# Altium project DB10005_DieBieMS.PrjPcb (part 2 of 2)

## Sheet DB10005_USBSerial.SchDoc: USB Serial interface
size A4; SheetNumber: 7; SheetTotal: 7
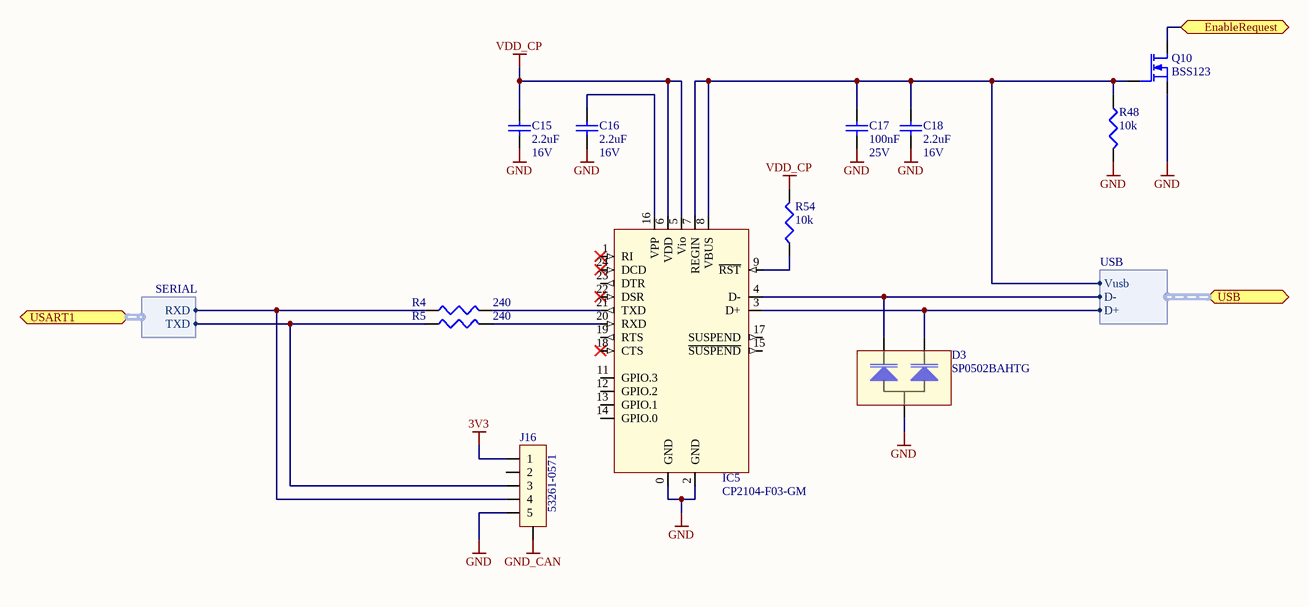
[diagram p7: DB10005_USBSerial.SchDoc]

### Parts
C15  2.2uF  Voltage Rating: 16V  [C0603]
C16  2.2uF  Voltage Rating: 16V  [C0603]
C17  100nF  Voltage Rating: 25V  [C0402]
C18  2.2uF  Voltage Rating: 16V  [C0603]
D3  SP0502BAHTG  [SOT23]
IC5  CP2104-F03-GM  [QFN24]
J16  53261-0571  [53261-0571]
Q10  BSS123  [SOT-23]
R4  240  [0402]
R5  240  [0402]
R48  10k  [0402]
R54  10k  [0402]

### Ports
EnableRequest, USART1 (harness SERIAL), USB (harness USB)

### Harnesses
USB: Vusb, D+, D-
SERIAL: RXD, TXD

### Nets
3V3: J16.1
GND: C15.1 C16.1 C17.1 C18.1 D3.A IC5.0(GND) IC5.2(GND) J16.5 Q10.S R48.1
GND_CAN: J16.0(SHLD)
VDD_CP: C15.2 IC5.5(Vio) IC5.6(VDD) R54.2
USB_RX: J16.4 R4.1 ; port USART1.RXD
USB_TX: J16.3 R5.1 ; port USART1.TXD
NetC16_2: C16.2 IC5.16(VPP)
NetC17_2: C17.2 C18.2 IC5.7(REGIN) IC5.8(VBUS) Q10.G R48.2 ; port USB.Vusb
NetD3_K1: D3.K1 IC5.4(D-) ; port USB.D-
NetD3_K2: D3.K2 IC5.3(D+) ; port USB.D+
NetD6_4: Q10.D ; port EnableRequest
NetIC5_9: IC5.9(~{RST}) R54.1
NetIC5_20: IC5.20(RXD) R5.2
NetIC5_21: IC5.21(TXD) R4.2

Not connected (* = marked no-connect by the designer): IC5 1(RI)* 11(GPIO.3) 12(GPIO.2) 13(GPIO.1) 14(GPIO.0) 15(~{SUSPEND}) 17(SUSPEND) 18(CTS)* 19(RTS) 22(DSR)* 23(DTR) 24(DCD)*; J16 2

### Notes on the sheet
- Title
- Size:
- Date:
- A4
- Number:
- Time:
- Revision:
- Sheet
- of
- File:

### Library data of the parts
C15 C16 C18 = 2.2uF/0603/CER/16V: Capacitor, 2.2uF, 16V, X5R; Capacitance Tolerance: +/- 10%; Capacitor Case Style: 0603; Brand Number: GRM188R61C225KE15D; Brand: MURATA; Dielectric Characteristic: X5R; Capacitance: 2.2uF; Temperature Range: -55°C to 85°C; Price: 0,077; Order Code Supplier: 1735526; Supplier: Farnell
C17 = 100nF/0402/CER/25V: Capacitor, 100nF, 25V, X7R; Capacitance Tolerance: 10nF; Capacitor Case Style: 0402; Brand Number: GRM155R71E104KE14D; Brand: MULTICOMP; Dielectric Characteristic: X7R; Capacitance: 100nF; Temperature Range: -55 to +125 C; Price: 0,0225; Order Code Supplier: 2456106; Supplier: Farnell
D3 = SP0502BAHTG: Diode TVS Dual, Vrwm: 5.5V Vc: 8V; Brand: LITTLEFUSE; Case Style: SOT-23; Brand Number: SP0502BAHTG; Clamping Voltage: 8V; Order Code Supplier: 1827631; Price: 0,80; Supplier: Farnell; Temperature Range: -40°C to +125°C; Vrwm: 5.5V
IC5 = CP2104-F03-GM: USB to UART converter; Case Style: QFN24; Price: 1,65; Order Code Supplier: 757-4983; Brand Number: CP2104-F03-GM; Supplier: RS-Components
J16 = 53261-0571: PicoBlade 53261 Series, 5Pin, Right Angle; Brand: MOLEX; Pitch: 1.25mm; Brand Number: 53261-0571; Case Style: 53261-0571; Order Code Supplier: 1125360; Price: 1,20; Supplier: Farnell
Q10 = BSS123: Mosfet, N-channel, Vds:100V, Id:0.15A, Vgs-th:2.8V, Rds-on:3.5ohm; Brand: NXP; Drain Current: 0.15A; Drain Source Voltage: 100V; Gate Source Voltage: 20V; On Resistance: 3.5ohm; Threshold Voltage: 2.8V; Brand Number: BSS123; Case Style: SOT-23; Order Code Supplier: 1510764; Price: 0,082; Supplier: Farnell; Temperature Range: -55°C to +150°C; Transistor Polarity: N-channel
R4 R5 = 240/0402/0063W/50V: Resistor, 240, 0.1%, 0.0625W, 50V, 100PPM, 0402; Brand: VISHAY DRALORIC; Brand Number: CRCW0402240RFKED; Power Rating: 0.063W; Case Style: 0402; Order Code Supplier: 2121522; Price: 0,0006; Resistance: 240; Supplier: Farnell; Temperature Coefficient: ± 100PPM; Temperature Range: -55°C to +125°C; Voltage Rating: 50V
R48 R54 = 10k/0402/0063W/50V: Resistor, 10k, 0.1%, 0.0625W, 50V, 100PPM, 0402; Brand: VISHAY DRALORIC; Brand Number: CRCW040210K0FKED; Power Rating: 0.063W; Case Style: 0402; Order Code Supplier: 2121730; Price: 0,0005; Resistance: 10k; Supplier: Farnell; Temperature Coefficient: ± 100PPM; Temperature Range: -55°C to +125°C; Voltage Rating: 50V

## Sheet DB10005_Wireless.SchDoc
size A4
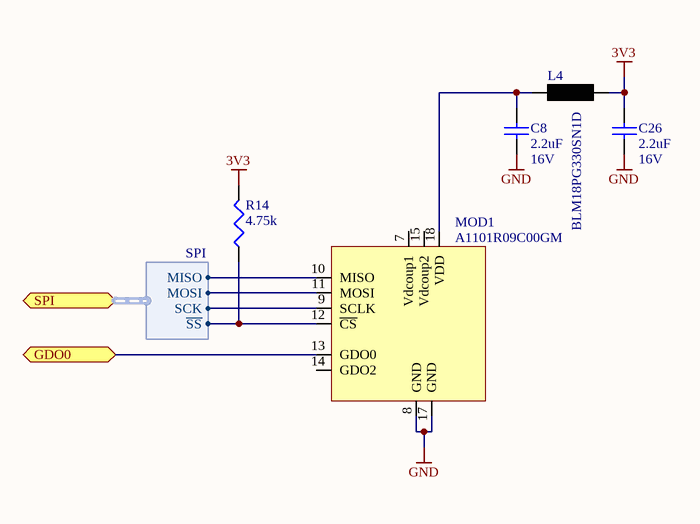
[diagram p8: DB10005_Wireless.SchDoc]

### Parts
C8  2.2uF  Voltage Rating: 16V  [C0603]
C26  2.2uF  Voltage Rating: 16V  [C0603]
L4  BLM18PG330SN1D  [L0603]
MOD1  A1101R09C00GM  [AxxLR09_Short]
R14  4.75k  [0402]

### Ports
GDO0, SPI (harness SPI)

### Harnesses
SPI: ~{SS}, SCK, MISO, MOSI

### Nets
3V3: C26.2 L4.2 R14.2
GND: C8.1 C26.1 MOD1.8(GND) MOD1.17(GND)
MISO: MOD1.10(MISO) ; port SPI.MISO
MOSI: MOD1.11(MOSI) ; port SPI.MOSI
SCK: MOD1.9(SCLK) ; port SPI.SCK
SPI_WT_SS: MOD1.12(~{CS}) R14.1 ; port SPI.~{SS}
Wireless_GDO0: MOD1.13(GDO0) ; port GDO0
NetC8_2: C8.2 L4.1 MOD1.18(VDD)

Not connected (* = marked no-connect by the designer): MOD1 7(Vdcoup1) 14(GDO2) 15(Vdcoup2)

### Library data of the parts
C8 C26 = 2.2uF/0603/CER/16V: as C15 on sheet DB10005_USBSerial; Dielectric Characteristic: X5R; Capacitance: 2.2uF; Temperature Range: -55°C to 85°C; Price: 0,077; Order Code Supplier: 1735526; Supplier: Farnell
L4 = BLM18PG330SN1D: Ferrite Bead, Impedance:33ohm, DC Resistance Max:0.025ohm, DC Current Rating:3A; Brand: MURATA; Case Style: 0603; Brand Number: BLM18PG330SN1D; Price: 0,048; Supplier: Farnell; Order Code Supplier: 1515742
MOD1 = A1101R09C00GM: SubRF tranceiver module; Brand: Anaren; Order Code Supplier: 2096118; Brand Number: A1101R09C00GM; Supplier: Farnell; Price: 12,47
R14 = 4.75k/0402/0063W/50V: Resistor, 4.75k, 0.1%, 0.0625W, 50V, 100PPM, 0402; Brand: VISHAY DRALORIC; Brand Number: CRCW04024K75FKED; Power Rating: 0.063W; Case Style: 0402; Order Code Supplier: 2121689; Price: 0,0006; Resistance: 4.75k; Supplier: Farnell; Temperature Coefficient: ± 100PPM; Temperature Range: -55°C to +125°C; Voltage Rating: 50V

## Sheet DB10005_Software.SchDoc
size A3 portrait
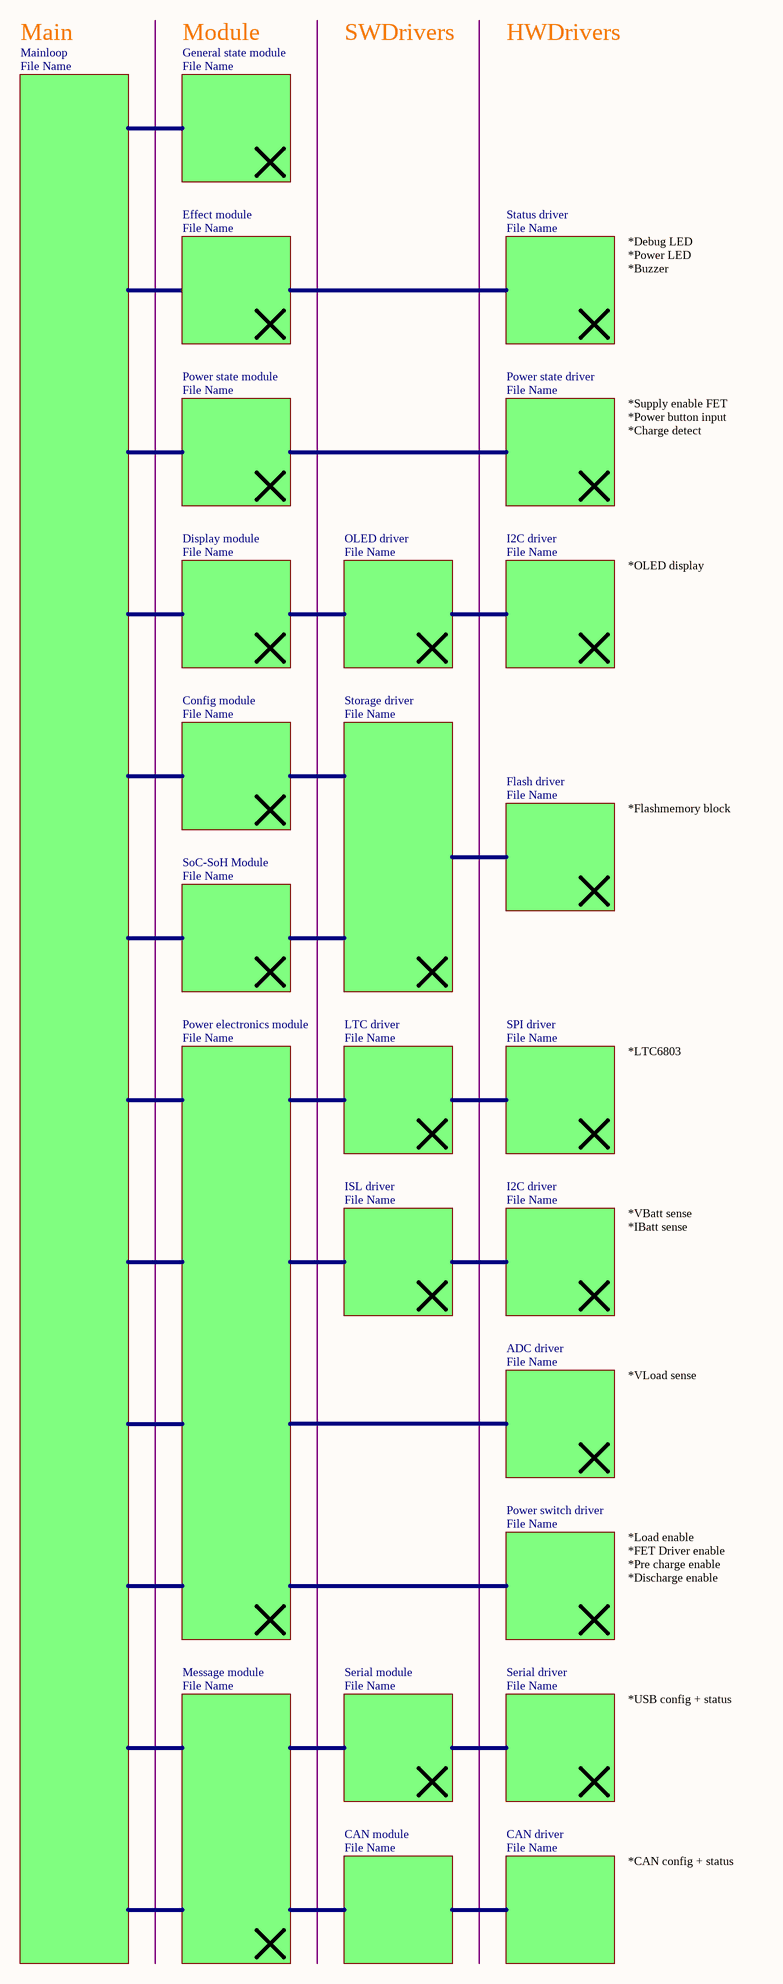
[diagram p9: DB10005_Software.SchDoc]

### Sub-sheets
ADC driver = File Name (file not in this document): no entries
CAN driver = File Name (file not in this document): no entries
CAN module = File Name (file not in this document): no entries
Config module = File Name (file not in this document): no entries
Display module = File Name (file not in this document): no entries
Effect module = File Name (file not in this document): no entries
Flash driver = File Name (file not in this document): no entries
General state module = File Name (file not in this document): no entries
I2C driver = File Name (file not in this document): no entries
I2C driver = File Name (file not in this document): no entries
ISL driver = File Name (file not in this document): no entries
LTC driver = File Name (file not in this document): no entries
Mainloop = File Name (file not in this document): no entries
Message module = File Name (file not in this document): no entries
OLED driver = File Name (file not in this document): no entries
Power electronics module = File Name (file not in this document): no entries
Power state driver = File Name (file not in this document): no entries
Power state module = File Name (file not in this document): no entries
Power switch driver = File Name (file not in this document): no entries
Serial driver = File Name (file not in this document): no entries
Serial module = File Name (file not in this document): no entries
SoC-SoH Module = File Name (file not in this document): no entries
SPI driver = File Name (file not in this document): no entries
Status driver = File Name (file not in this document): no entries
Storage driver = File Name (file not in this document): no entries

### Notes on the sheet
- Main
- Module
- SWDrivers
- HWDrivers
- *Debug LED
- *Power LED
- *Buzzer
- *Supply enable FET
- *Power button input
- *Charge detect
- *OLED display
- *Flashmemory block
- *LTC6803
- *VBatt sense
- *IBatt sense
- *VLoad sense
- *FET Driver enable
- *Pre charge enable
- *Load enable
- *Discharge enable
- *USB config + status
- *CAN config + status
- Title
- Size:
- Date:
- A3
- Number:
- Time:
- Revision:
- Sheet
- of
- File:

## Nets that join several sheets
3V3: DB10005_TopLevel (8 pins), DB10005_Controller (12 pins), DB10005_PowerSwitch (5 pins), DB10005_PowerManagement (C36.2 D15.1 D16.1 R41.1), DB10005_CAN (C11.2 C12.2 IC4.1), DB10005_USBSerial (J16.1), DB10005_Wireless (C26.2 L4.2 R14.2)
5V_CAN: DB10005_TopLevel (J6.2 J9.2 TP2.1), DB10005_CAN (C13.2 C14.2 IC4.8)
GND: DB10005_TopLevel (17 pins), DB10005_BatteryStackMonitor (17 pins), Battery stack monitor/CELL1 (C25_CELL1.1), Battery stack monitor/CELL2 (C25_CELL2.1), Battery stack monitor/CELL3 (C25_CELL3.1), Battery stack monitor/CELL4 (C25_CELL4.1), Battery stack monitor/CELL5 (C25_CELL5.1), Battery stack monitor/CELL6 (C25_CELL6.1), Battery stack monitor/CELL7 (C25_CELL7.1), Battery stack monitor/CELL8 (C25_CELL8.1), Battery stack monitor/CELL9 (C25_CELL9.1), Battery stack monitor/CELL10 (C25_CELL10.1), Battery stack monitor/CELL11 (C25_CELL11.1), Battery stack monitor/CELL12 (C25_CELL12.1), DB10005_Controller (19 pins), DB10005_PowerSwitch (22 pins), DB10005_PowerManagement (16 pins), DB10005_CAN (6 pins), DB10005_USBSerial (10 pins), DB10005_Wireless (C8.1 C26.1 MOD1.8 MOD1.17)
GND_CAN: DB10005_TopLevel (5 pins), DB10005_CAN (7 pins), DB10005_USBSerial (J16.0)
BATT+: DB10005_TopLevel (J2.1), DB10005_PowerSwitch (5 pins)
Buzzer: DB10005_TopLevel (Q11.G R72.1), DB10005_Controller (IC1.38)
C1: DB10005_BatteryStackMonitor (U1.24), Battery stack monitor/CELL1 (C25_CELL1.2 D23_CELL1.2 R36_CELL1.2), Battery stack monitor/CELL2 (D23_CELL2.1)
C2: DB10005_BatteryStackMonitor (U1.22), Battery stack monitor/CELL2 (C25_CELL2.2 D23_CELL2.2 R36_CELL2.2), Battery stack monitor/CELL3 (D23_CELL3.1)
C3: DB10005_BatteryStackMonitor (U1.20), Battery stack monitor/CELL3 (C25_CELL3.2 D23_CELL3.2 R36_CELL3.2), Battery stack monitor/CELL4 (D23_CELL4.1)
C4: DB10005_BatteryStackMonitor (U1.18), Battery stack monitor/CELL4 (C25_CELL4.2 D23_CELL4.2 R36_CELL4.2), Battery stack monitor/CELL5 (D23_CELL5.1)
C5: DB10005_BatteryStackMonitor (U1.16), Battery stack monitor/CELL5 (C25_CELL5.2 D23_CELL5.2 R36_CELL5.2), Battery stack monitor/CELL6 (D23_CELL6.1)
C6: DB10005_BatteryStackMonitor (U1.14), Battery stack monitor/CELL6 (C25_CELL6.2 D23_CELL6.2 R36_CELL6.2), Battery stack monitor/CELL7 (D23_CELL7.1)
C7: DB10005_BatteryStackMonitor (U1.12), Battery stack monitor/CELL7 (C25_CELL7.2 D23_CELL7.2 R36_CELL7.2), Battery stack monitor/CELL8 (D23_CELL8.1)
C8: DB10005_BatteryStackMonitor (U1.10), Battery stack monitor/CELL8 (C25_CELL8.2 D23_CELL8.2 R36_CELL8.2), Battery stack monitor/CELL9 (D23_CELL9.1)
C9: DB10005_BatteryStackMonitor (U1.8), Battery stack monitor/CELL9 (C25_CELL9.2 D23_CELL9.2 R36_CELL9.2), Battery stack monitor/CELL10 (D23_CELL10.1)
C10: DB10005_BatteryStackMonitor (U1.6), Battery stack monitor/CELL10 (C25_CELL10.2 D23_CELL10.2 R36_CELL10.2), Battery stack monitor/CELL11 (D23_CELL11.1)
C11: DB10005_BatteryStackMonitor (U1.4), Battery stack monitor/CELL11 (C25_CELL11.2 D23_CELL11.2 R36_CELL11.2), Battery stack monitor/CELL12 (D23_CELL12.1)
C12: DB10005_BatteryStackMonitor (U1.2), Battery stack monitor/CELL12 (C25_CELL12.2 D23_CELL12.2 R36_CELL12.2)
CAN_RX: DB10005_Controller (IC1.32), DB10005_CAN (IC4.2)
CAN_TX: DB10005_Controller (IC1.33), DB10005_CAN (IC4.3)
CANH: DB10005_TopLevel (J6.4 J9.4 R69.2 TP4.1), DB10005_CAN (D1.K1 IC4.7)
CANL: DB10005_TopLevel (J6.3 J9.3 R69.1 TP5.1), DB10005_CAN (D1.K2 IC4.6)
ChargeEnable: DB10005_Controller (IC1.18), DB10005_PowerSwitch (Q12.D R22.1)
ChargeIn: DB10005_TopLevel (J1.1), DB10005_PowerSwitch (D7.A1 D7.A2 D8.2)
CM1: DB10005_BatteryStackMonitor (R56.2), Battery stack monitor/CELL1 (D23_CELL1.1)
CN1: DB10005_TopLevel (J12.1), DB10005_BatteryStackMonitor (R52.2), Battery stack monitor/CELL1 (R38_CELL1.1 R39_CELL1.1)
CN2: DB10005_TopLevel (J12.2), Battery stack monitor/CELL1 (F2_CELL1.1 Q5_CELL1.S R36_CELL1.1 R39_CELL1.2), Battery stack monitor/CELL2 (R38_CELL2.1 R39_CELL2.1)
CN3: DB10005_TopLevel (J12.3), Battery stack monitor/CELL2 (F2_CELL2.1 Q5_CELL2.S R36_CELL2.1 R39_CELL2.2), Battery stack monitor/CELL3 (R38_CELL3.1 R39_CELL3.1)
CN4: DB10005_TopLevel (J12.4), Battery stack monitor/CELL3 (F2_CELL3.1 Q5_CELL3.S R36_CELL3.1 R39_CELL3.2), Battery stack monitor/CELL4 (R38_CELL4.1 R39_CELL4.1)
CN5: DB10005_TopLevel (J12.5), Battery stack monitor/CELL4 (F2_CELL4.1 Q5_CELL4.S R36_CELL4.1 R39_CELL4.2), Battery stack monitor/CELL5 (R38_CELL5.1 R39_CELL5.1)
CN6: DB10005_TopLevel (J12.6), Battery stack monitor/CELL5 (F2_CELL5.1 Q5_CELL5.S R36_CELL5.1 R39_CELL5.2), Battery stack monitor/CELL6 (R38_CELL6.1 R39_CELL6.1)
CN7: DB10005_TopLevel (J12.7), Battery stack monitor/CELL6 (F2_CELL6.1 Q5_CELL6.S R36_CELL6.1 R39_CELL6.2), Battery stack monitor/CELL7 (R38_CELL7.1 R39_CELL7.1)
CN8: DB10005_TopLevel (J12.8), Battery stack monitor/CELL7 (F2_CELL7.1 Q5_CELL7.S R36_CELL7.1 R39_CELL7.2), Battery stack monitor/CELL8 (R38_CELL8.1 R39_CELL8.1)
CN9: DB10005_TopLevel (J12.9), Battery stack monitor/CELL8 (F2_CELL8.1 Q5_CELL8.S R36_CELL8.1 R39_CELL8.2), Battery stack monitor/CELL9 (R38_CELL9.1 R39_CELL9.1)
CN10: DB10005_TopLevel (J12.10), Battery stack monitor/CELL9 (F2_CELL9.1 Q5_CELL9.S R36_CELL9.1 R39_CELL9.2), Battery stack monitor/CELL10 (R38_CELL10.1 R39_CELL10.1)
CN11: DB10005_TopLevel (J12.11), Battery stack monitor/CELL10 (F2_CELL10.1 Q5_CELL10.S R36_CELL10.1 R39_CELL10.2), Battery stack monitor/CELL11 (R38_CELL11.1 R39_CELL11.1)
CN12: DB10005_TopLevel (J12.12), Battery stack monitor/CELL11 (F2_CELL11.1 Q5_CELL11.S R36_CELL11.1 R39_CELL11.2), Battery stack monitor/CELL12 (R38_CELL12.1 R39_CELL12.1)
CP12: DB10005_TopLevel (J12.13), Battery stack monitor/CELL12 (F2_CELL12.1 Q5_CELL12.S R36_CELL12.1 R39_CELL12.2)
DischargeEnable: DB10005_Controller (IC1.21), DB10005_PowerSwitch (Q13.D R24.1)
Enable_CAN: DB10005_TopLevel (J6.1 J9.1 TP1.1), DB10005_CAN (R2.2)
LED0: DB10005_TopLevel (R9.2), DB10005_Controller (IC1.19)
LoadOut: DB10005_TopLevel (J3.1), DB10005_PowerSwitch (7 pins)
MISO: DB10005_BatteryStackMonitor (U1.43), DB10005_Controller (IC1.16 R66.1), DB10005_Wireless (MOD1.10)
MOSI: DB10005_BatteryStackMonitor (R61.1 U1.42), DB10005_Controller (IC1.17), DB10005_Wireless (MOD1.11)
NetC17_2: DB10005_TopLevel (J7.1), DB10005_USBSerial (6 pins)
NetC40_2: DB10005_TopLevel (J12.16), DB10005_BatteryStackMonitor (C40.2 R50.1 U1.28)
NetC41_2: DB10005_TopLevel (J12.14), DB10005_BatteryStackMonitor (C41.2 R51.1 U1.29)
NetC42_1: DB10005_Controller (C42.1 IC1.10 R8.1), DB10005_PowerSwitch (R71.2 R74.2)
NetD2_4: DB10005_Controller (Q8.G), DB10005_PowerSwitch (D2.4), DB10005_PowerManagement (D14.2 R47.1)
NetD3_K1: DB10005_TopLevel (J7.2), DB10005_USBSerial (D3.K1 IC5.4)
NetD3_K2: DB10005_TopLevel (J7.3), DB10005_USBSerial (D3.K2 IC5.3)
NetD6_4: DB10005_PowerManagement (D19.2), DB10005_CAN (D6.4), DB10005_USBSerial (Q10.D)
NetF1_1: DB10005_TopLevel (F1.1), DB10005_BatteryStackMonitor (L2.1), DB10005_PowerManagement (R55.2)
NetIC1_2: DB10005_BatteryStackMonitor (R59.1 U1.36), DB10005_Controller (IC1.2), DB10005_PowerSwitch (Q12.G Q13.G)
NetJ12_15: DB10005_TopLevel (J12.15), DB10005_BatteryStackMonitor (R65.2)
OLED_RST: DB10005_TopLevel (J13.2 R20.1 TP11.1), DB10005_Controller (IC1.45)
OLED_SCL: DB10005_TopLevel (J13.4 R19.1 TP9.1), DB10005_Controller (IC1.42)
OLED_SDA: DB10005_TopLevel (J13.3 R18.1 TP10.1), DB10005_Controller (IC1.43)
PowerButton: DB10005_Controller (IC1.40), DB10005_PowerManagement (Q9.D)
PowerEnable: DB10005_Controller (IC1.41), DB10005_PowerManagement (Q7.G R53.1)
PowerLED: DB10005_TopLevel (R70.1), DB10005_Controller (IC1.39)
PreChargeEnable: DB10005_Controller (IC1.22), DB10005_PowerSwitch (R25.1)
PushButton: DB10005_TopLevel (J14.2), DB10005_PowerManagement (R3.2)
~{RST}: DB10005_TopLevel (J10.2 TP6.1), DB10005_Controller (C5.2 IC1.7 R1.1)
S1: DB10005_BatteryStackMonitor (U1.25), Battery stack monitor/CELL1 (R37_CELL1.2)
S2: DB10005_BatteryStackMonitor (U1.23), Battery stack monitor/CELL2 (R37_CELL2.2)
S3: DB10005_BatteryStackMonitor (U1.21), Battery stack monitor/CELL3 (R37_CELL3.2)
S4: DB10005_BatteryStackMonitor (U1.19), Battery stack monitor/CELL4 (R37_CELL4.2)
S5: DB10005_BatteryStackMonitor (U1.17), Battery stack monitor/CELL5 (R37_CELL5.2)
S6: DB10005_BatteryStackMonitor (U1.15), Battery stack monitor/CELL6 (R37_CELL6.2)
S7: DB10005_BatteryStackMonitor (U1.13), Battery stack monitor/CELL7 (R37_CELL7.2)
S8: DB10005_BatteryStackMonitor (U1.11), Battery stack monitor/CELL8 (R37_CELL8.2)
S9: DB10005_BatteryStackMonitor (U1.9), Battery stack monitor/CELL9 (R37_CELL9.2)
S10: DB10005_BatteryStackMonitor (U1.7), Battery stack monitor/CELL10 (R37_CELL10.2)
S11: DB10005_BatteryStackMonitor (U1.5), Battery stack monitor/CELL11 (R37_CELL11.2)
S12: DB10005_BatteryStackMonitor (U1.3), Battery stack monitor/CELL12 (R37_CELL12.2)
~{SS}: DB10005_BatteryStackMonitor (R62.1 U1.44), DB10005_Controller (IC1.14)
SCK: DB10005_BatteryStackMonitor (R60.1 U1.41), DB10005_Controller (IC1.15), DB10005_Wireless (MOD1.9)
SCL: DB10005_Controller (IC1.30), DB10005_PowerSwitch (IC6.5 R13.1)
SDA: DB10005_Controller (IC1.31), DB10005_PowerSwitch (IC6.4 R49.1)
SPI_WT_SS: DB10005_Controller (IC1.29), DB10005_Wireless (MOD1.12 R14.1)
SWCLK: DB10005_TopLevel (J10.4 TP8.1), DB10005_Controller (IC1.37)
SWDIO: DB10005_TopLevel (J10.3 TP7.1), DB10005_Controller (IC1.34)
SwitchEnable: DB10005_Controller (IC1.20 R68.1), DB10005_PowerSwitch (R23.1)
USB_RX: DB10005_Controller (IC1.13), DB10005_USBSerial (J16.4 R4.1)
USB_TX: DB10005_Controller (IC1.12), DB10005_USBSerial (J16.3 R5.1)
VoutSense: DB10005_Controller (IC1.11), DB10005_PowerSwitch (C27.2 R21.2 R40.2)
Wireless_GDO0: DB10005_Controller (IC1.4), DB10005_Wireless (MOD1.13)

## Assembly variants
Production: not fitted C6 C8 C26 J15 L3 L4 MOD1 R39_CELL1 R39_CELL2 R39_CELL3 R39_CELL4 R39_CELL5 R39_CELL6 R39_CELL7 R39_CELL8 R39_CELL9 R39_CELL10 R39_CELL11 R39_CELL12 R64 R69 R71